# Altium project GL3520 4 Ports.PrjPcb
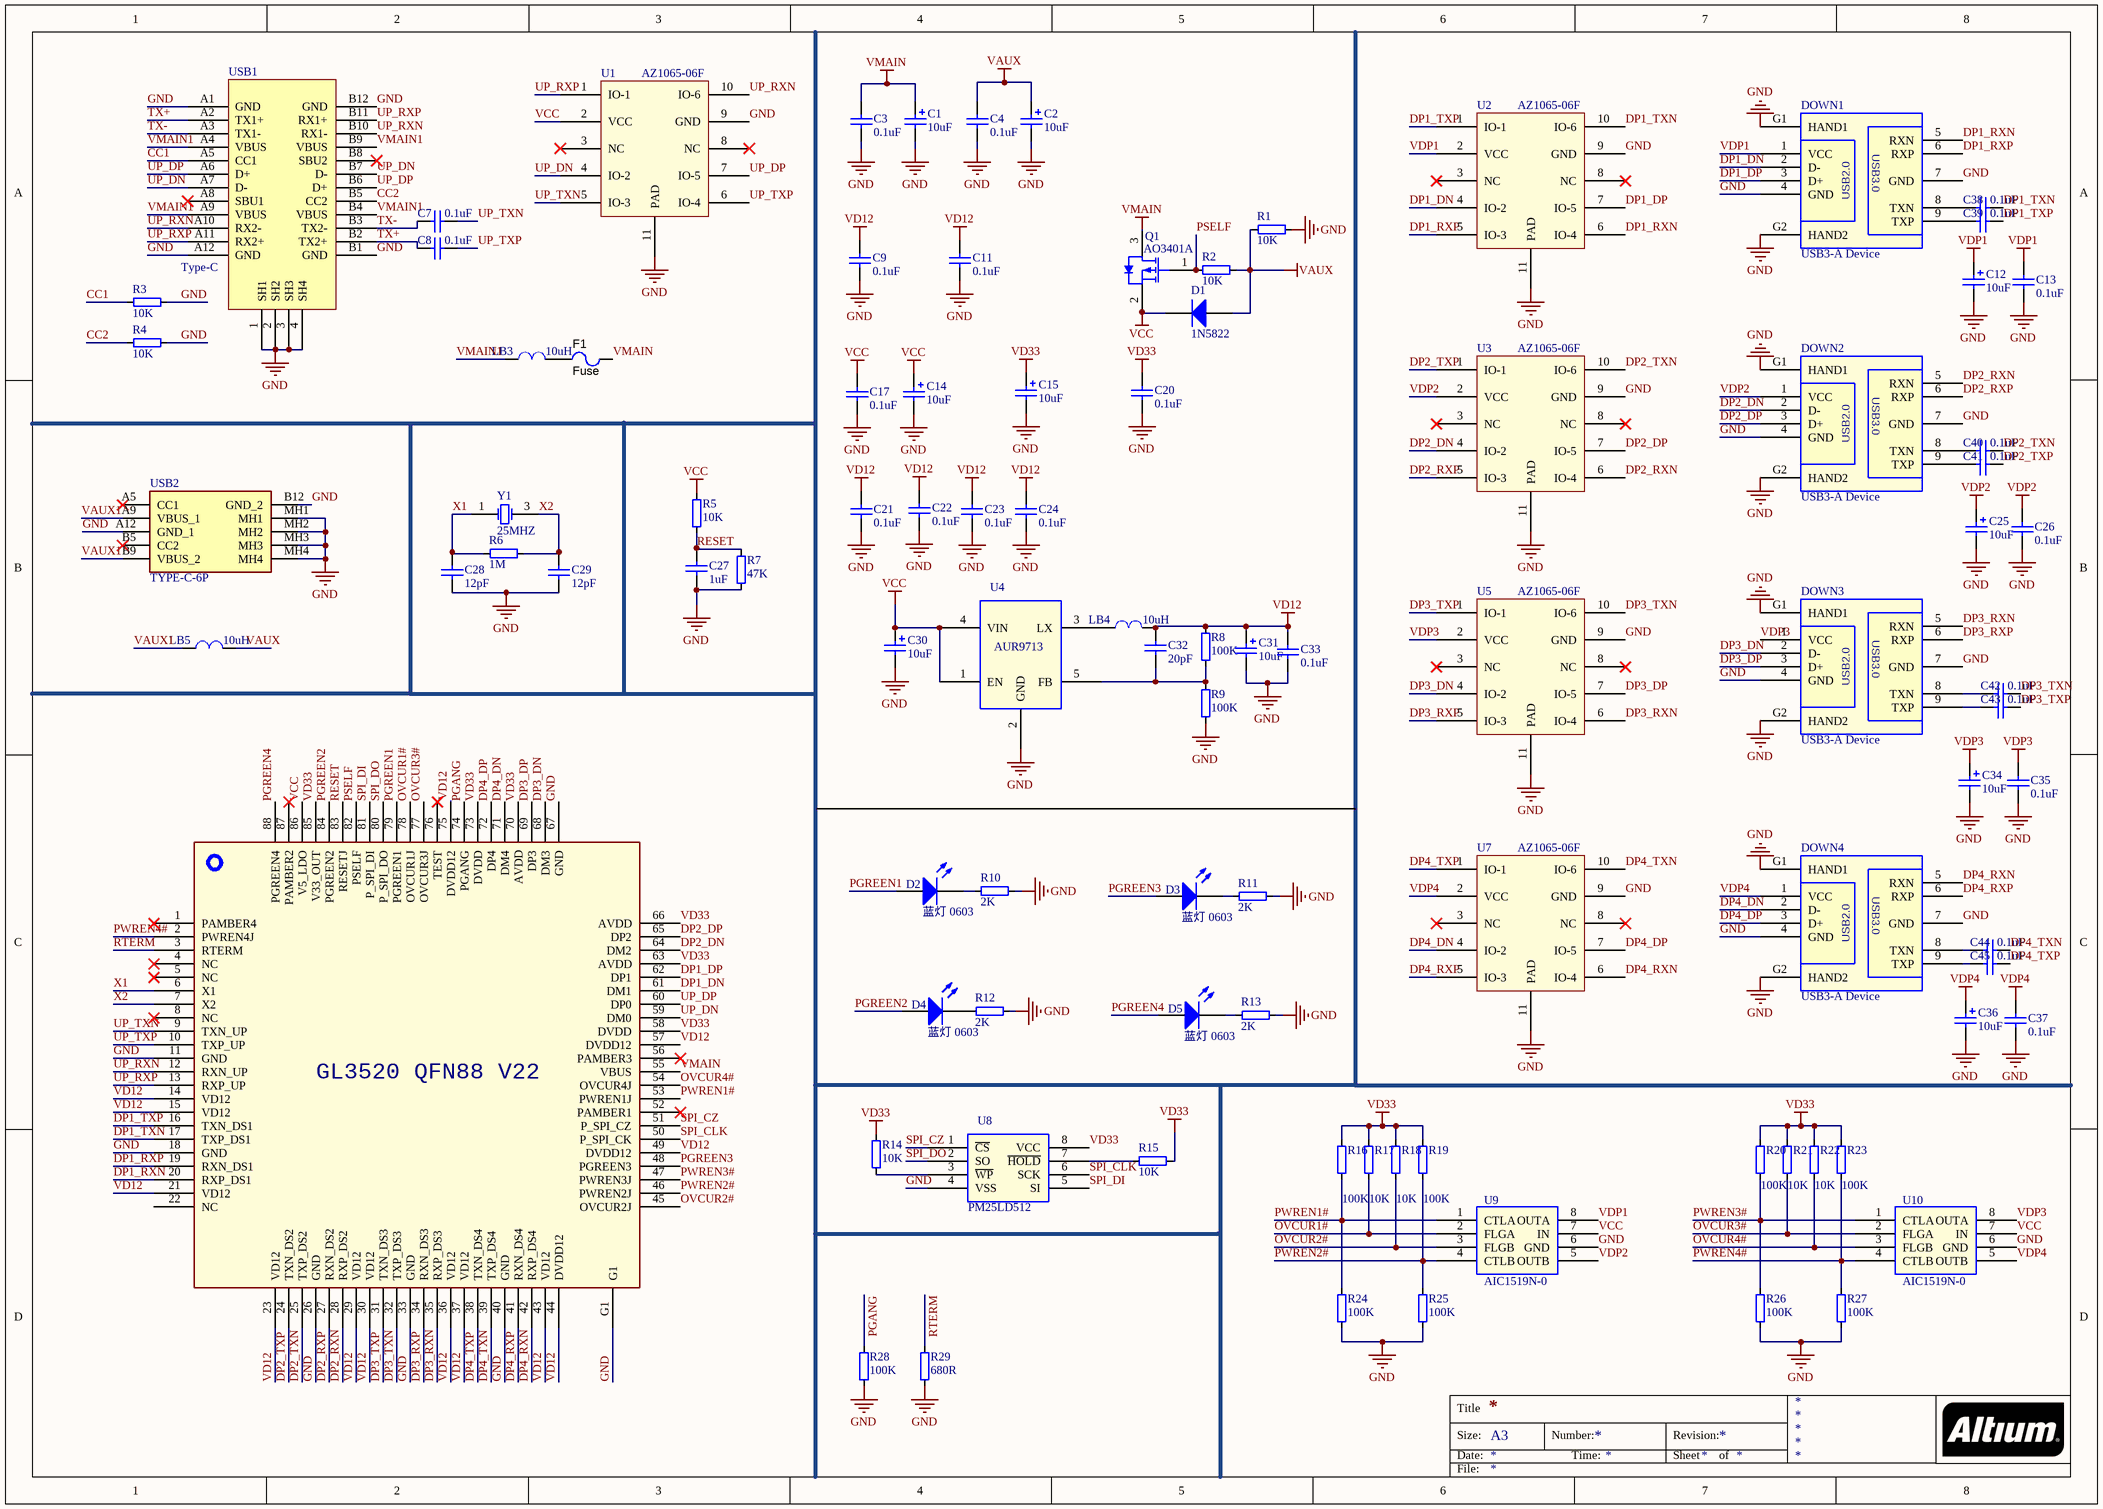
[diagram p0: GL3520 4 Ports.SchDoc]
1 sheet, 95 parts. Net scope: global (net labels, ports and power ports of the same name join across sheets).
Board files: GL3520 4 Ports.PcbDoc, GL3520 4 Ports (final).PcbDoc

## Sheet GL3520 4 Ports.SchDoc
size A3

### Parts
C1  10uF  [CASE-A_3216]
C2  10uF  [CASE-A_3216]
C3  0.1uF  [C 0603_L]
C4  0.1uF  [C 0603_L]
C7  0.1uF  [C 0603_L]
C8  0.1uF  [C 0603_L]
C9  0.1uF  [C 0603_L]
C11  0.1uF  [C 0603_L]
C12  10uF  [CASE-A_3216]
C13  0.1uF  [C 0603_L]
C14  10uF  [CASE-A_3216]
C15  10uF  [CASE-A_3216]
C17  0.1uF  [C 0603_L]
C20  0.1uF  [C 0603_L]
C21  0.1uF  [C 0603_L]
C22  0.1uF  [C 0603_L]
C23  0.1uF  [C 0603_L]
C24  0.1uF  [C 0603_L]
C25  10uF  [CASE-A_3216]
C26  0.1uF  [C 0603_L]
C27  1uF  [C 0603_L]
C28  12pF  [C 0603_L]
C29  12pF  [C 0603_L]
C30  10uF  [CASE-A_3216]
C31  10uF  [CASE-A_3216]
C32  20pF  [C 0603_L]
C33  0.1uF  [C 0603_L]
C34  10uF  [CASE-A_3216]
C35  0.1uF  [C 0603_L]
C36  10uF  [CASE-A_3216]
C37  0.1uF  [C 0603_L]
C38  0.1uF  [C 0603_L]
C39  0.1uF  [C 0603_L]
C40  0.1uF  [C 0603_L]
C41  0.1uF  [C 0603_L]
C42  0.1uF  [C 0603_L]
C43  0.1uF  [C 0603_L]
C44  0.1uF  [C 0603_L]
C45  0.1uF  [C 0603_L]
D1  1N5822  [SMA]
D2  蓝灯 0603  [0603_LED_S1]
D3  蓝灯 0603  [0603_LED_S1]
D4  蓝灯 0603  [0603_LED_S1]
D5  蓝灯 0603  [0603_LED_S1]
DOWN1  USB3-A Device  [USB3.0-1 - duplicate]
DOWN2  USB3-A Device  [USB3.0-1 - duplicate]
DOWN3  USB3-A Device  [USB3.0-1 - duplicate]
DOWN4  USB3-A Device  [USB3.0-1 - duplicate]
F1  Fuse  [FU 1206]
LB3  10uH  [CD43]
LB4  10uH  [CD43]
LB5  10uH  [CD43]
Q1  AO3401A  [SOT23-3L]
R1  10K  [R 0603_L]
R2  10K  [R 0603_L]
R3  10K  [R 0603_L]
R4  10K  [R 0603_L]
R5  10K  [R 0603_L]
R6  1M  [R 0603_L]
R7  47K  [R 0603_L]
R8  100K  [R 0603_L]
R9  100K  [R 0603_L]
R10  2K  [R 0603_L]
R11  2K  [R 0603_L]
R12  2K  [R 0603_L]
R13  2K  [R 0603_L]
R14  10K  [R 0603_L]
R15  10K  [R 0603_L]
R16  100K  [R 0603_L]
R17  10K  [R 0603_L]
R18  10K  [R 0603_L]
R19  100K  [R 0603_L]
R20  100K  [R 0603_L]
R21  10K  [R 0603_L]
R22  10K  [R 0603_L]
R23  100K  [R 0603_L]
R24  100K  [R 0603_L]
R25  100K  [R 0603_L]
R26  100K  [R 0603_L]
R27  100K  [R 0603_L]
R28  100K  [R 0603_L]
R29  680R  [R 0603_L]
U1  AZ1065-06F  [DFN4120P10E]
U2  AZ1065-06F  [DFN4120P10E]
U3  AZ1065-06F  [DFN4120P10E]
U4  AUR9713  [SOT23-5L]
U5  AZ1065-06F  [DFN4120P10E]
U6  GL3520_QFN88_V094-1_22  [QFN88]  (value not drawn)
U7  AZ1065-06F  [DFN4120P10E]
U8  PM25LD512  [SOP8W_M]
U9  AIC1519N-0  [SOP8_L]
U10  AIC1519N-0  [SOP8_L]
USB1  Type-C  [USB_TYPE_C_24P - duplicate - duplicate]
USB2  TYPE-C-6P  [USB_TYPE_C_6P]
Y1  25MHZ  [OSC 3225-4P]

### Nets
GND: C1.2 C2.2 C3.1 C4.1 C9.1 C11.1 C12.2 C13.1 C14.2 C15.2 C17.1 C20.1 C21.1 C22.1 C23.1 C24.1 C25.2 C26.1 C27.1 C28.1 C29.1 C30.2 C31.2 C33.1 C34.2 C35.1 C36.2 C37.1 DOWN1.4(GND) DOWN1.7(GND) DOWN1.G1(HAND1) DOWN1.G2(HAND2) DOWN2.4(GND) DOWN2.7(GND) DOWN2.G1(HAND1) DOWN2.G2(HAND2) DOWN3.4(GND) DOWN3.7(GND) DOWN3.G1(HAND1) DOWN3.G2(HAND2) DOWN4.4(GND) DOWN4.7(GND) DOWN4.G1(HAND1) DOWN4.G2(HAND2) R1.2 R3.2 R4.2 R7.1 R9.2 R10.1 R11.1 R12.1 R13.1 R24.2 R25.2 R26.2 R27.2 R28.2 R29.2 U1.9(GND) U1.11(PAD) U2.9(GND) U2.11(PAD) U3.9(GND) U3.11(PAD) U4.2(GND) U5.9(GND) U5.11(PAD) U6.11(GND) U6.18(GND) U6.26(GND) U6.33(GND) U6.40(GND) U6.67(GND) U6.G1 U7.9(GND) U7.11(PAD) U8.4(VSS) U9.6(GND) U10.6(GND) USB1.1(SH1) USB1.2(SH2) USB1.3(SH3) USB1.4(SH4) USB1.A1(GND) USB1.A12(GND) USB1.B1(GND) USB1.B12(GND) USB2.A12(GND_1) USB2.B12(GND_2) USB2.MH1 USB2.MH2 USB2.MH3 USB2.MH4
VAUX: C2.1 C4.2 D1.1(A) LB5.2 R1.1 R2.2
VCC: C14.1 C17.2 C30.1 D1.2(K) Q1.2(SOURCE) R5.2 U1.2(VCC) U4.1(EN) U4.4(VIN) U6.86(V5_LDO) U9.7(IN) U10.7(IN)
VD12: C9.2 C11.2 C21.2 C22.2 C23.2 C24.2 C31.1 C32.2 C33.2 LB4.2 R8.1 U6.14(VD12) U6.15(VD12) U6.21(VD12) U6.23(VD12) U6.29(VD12) U6.30(VD12) U6.36(VD12) U6.37(VD12) U6.43(VD12) U6.44(DVDD12) U6.49(DVDD12) U6.57(DVDD12) U6.75(DVDD12)
VD33: C15.1 C20.2 R14.1 R15.2 R16.1 R17.1 R18.1 R19.1 R20.1 R21.1 R22.1 R23.1 U6.58(DVDD) U6.63(AVDD) U6.66(AVDD) U6.70(AVDD) U6.73(DVDD) U6.85(V33_OUT) U8.8(VCC)
VDP1: C12.1 C13.2 DOWN1.1(VCC) U2.2(VCC) U9.8(OUTA)
VDP2: C25.1 C26.2 DOWN2.1(VCC) U3.2(VCC) U9.5(OUTB)
VDP3: C34.1 C35.2 DOWN3.1(VCC) U5.2(VCC) U10.8(OUTA)
VDP4: C36.1 C37.2 DOWN4.1(VCC) U7.2(VCC) U10.5(OUTB)
VMAIN: C1.1 C3.2 F1.1 Q1.3(DRAIN) U6.55(VBUS)
CC1: R3.1 USB1.A5(CC1)
CC2: R4.1 USB1.B5(CC2)
DP1_DN: DOWN1.2(D-) U2.4(IO-2) U6.61(DM1)
DP1_DP: DOWN1.3(D+) U2.7(IO-5) U6.62(DP1)
DP1_RXN: DOWN1.5(RXN) U2.6(IO-4) U6.20(RXP_DS1)
DP1_RXP: DOWN1.6(RXP) U2.5(IO-3) U6.19(RXN_DS1)
DP1_TXN: C38.1 U2.10(IO-6) U6.17(TXP_DS1)
DP1_TXP: C39.1 U2.1(IO-1) U6.16(TXN_DS1)
DP2_DN: DOWN2.2(D-) U3.4(IO-2) U6.64(DM2)
DP2_DP: DOWN2.3(D+) U3.7(IO-5) U6.65(DP2)
DP2_RXN: DOWN2.5(RXN) U3.6(IO-4) U6.28(RXP_DS2)
DP2_RXP: DOWN2.6(RXP) U3.5(IO-3) U6.27(RXN_DS2)
DP2_TXN: C40.1 U3.10(IO-6) U6.25(TXP_DS2)
DP2_TXP: C41.1 U3.1(IO-1) U6.24(TXN_DS2)
DP3_DN: DOWN3.2(D-) U5.4(IO-2) U6.68(DM3)
DP3_DP: DOWN3.3(D+) U5.7(IO-5) U6.69(DP3)
DP3_RXN: DOWN3.5(RXN) U5.6(IO-4) U6.35(RXP_DS3)
DP3_RXP: DOWN3.6(RXP) U5.5(IO-3) U6.34(RXN_DS3)
DP3_TXN: C42.1 U5.10(IO-6) U6.32(TXP_DS3)
DP3_TXP: C43.1 U5.1(IO-1) U6.31(TXN_DS3)
DP4_DN: DOWN4.2(D-) U6.71(DM4) U7.4(IO-2)
DP4_DP: DOWN4.3(D+) U6.72(DP4) U7.7(IO-5)
DP4_RXN: DOWN4.5(RXN) U6.42(RXP_DS4) U7.6(IO-4)
DP4_RXP: DOWN4.6(RXP) U6.41(RXN_DS4) U7.5(IO-3)
DP4_TXN: C44.1 U6.39(TXP_DS4) U7.10(IO-6)
DP4_TXP: C45.1 U6.38(TXN_DS4) U7.1(IO-1)
OVCUR1#: R17.2 U6.78(OVCUR1J) U9.2(FLGA)
OVCUR2#: R18.2 U6.45(OVCUR2J) U9.3(FLGB)
OVCUR3#: R21.2 U6.77(OVCUR3J) U10.2(FLGA)
OVCUR4#: R22.2 U6.54(OVCUR4J) U10.3(FLGB)
PGANG: R28.1 U6.74(PGANG)
PGREEN1: D2.A U6.79(PGREEN1)
PGREEN2: D4.A U6.84(PGREEN2)
PGREEN3: D3.A U6.48(PGREEN3)
PGREEN4: D5.A U6.88(PGREEN4)
PSELF: Q1.1(GATE) R2.1 U6.82(PSELF)
PWREN1#: R16.2 R24.1 U6.53(PWREN1J) U9.1(CTLA)
PWREN2#: R19.2 R25.1 U6.46(PWREN2J) U9.4(CTLB)
PWREN3#: R20.2 R26.1 U6.47(PWREN3J) U10.1(CTLA)
PWREN4#: R23.2 R27.1 U6.2(PWREN4J) U10.4(CTLB)
RESET: C27.2 R5.1 R7.2 U6.83(RESETJ)
RTERM: R29.1 U6.3(RTERM)
SPI_CLK: U6.50(P_SPI_CK) U8.6(SCK)
SPI_CZ: U6.51(P_SPI_CZ) U8.1(~{CS})
SPI_DI: U6.81(P_SPI_DI) U8.5(SI)
SPI_DO: U6.80(P_SPI_DO) U8.2(SO)
TX+: C8.2 USB1.A2(TX1+) USB1.B2(TX2+)
TX-: C7.2 USB1.A3(TX1-) USB1.B3(TX2-)
UP_DN: U1.4(IO-2) U6.59(DM0) USB1.A7(D-) USB1.B7(D-)
UP_DP: U1.7(IO-5) U6.60(DP0) USB1.A6(D+) USB1.B6(D+)
UP_RXN: U1.10(IO-6) U6.12(RXN_UP) USB1.A10(RX2-) USB1.B10(RX1-)
UP_RXP: U1.1(IO-1) U6.13(RXP_UP) USB1.A11(RX2+) USB1.B11(RX1+)
UP_TXN: C7.1 U1.5(IO-3) U6.9(TXN_UP)
UP_TXP: C8.1 U1.6(IO-4) U6.10(TXP_UP)
VAUX1: LB5.1 USB2.A9(VBUS_1) USB2.B9(VBUS_2)
VMAIN1: LB3.1 USB1.A4(VBUS) USB1.A9(VBUS) USB1.B4(VBUS) USB1.B9(VBUS)
X1: C28.2 R6.1 U6.6(X1) Y1.1(OSC1)
X2: C29.2 R6.2 U6.7(X2) Y1.3(OSC2)
NetC32_1: C32.1 R8.2 R9.1 U4.5(FB)
NetC38_2: C38.2 DOWN1.8(TXN)
NetC39_2: C39.2 DOWN1.9(TXP)
NetC40_2: C40.2 DOWN2.8(TXN)
NetC41_2: C41.2 DOWN2.9(TXP)
NetC42_2: C42.2 DOWN3.8(TXN)
NetC43_2: C43.2 DOWN3.9(TXP)
NetC44_2: C44.2 DOWN4.8(TXN)
NetC45_2: C45.2 DOWN4.9(TXP)
NetD2_K: D2.K R10.2
NetD3_K: D3.K R11.2
NetD4_K: D4.K R12.2
NetD5_K: D5.K R13.2
NetF1_2: F1.2 LB3.2
NetLB4_1: LB4.1 U4.3(LX)
NetR14_2: R14.2 U8.3(~{WP})
NetR15_1: R15.1 U8.7(~{HOLD})

Not connected (* = marked no-connect by the designer): U1 3(NC)* 8(NC)*; U2 3(NC)* 8(NC)*; U3 3(NC)* 8(NC)*; U5 3(NC)* 8(NC)*; U6 1(PAMBER4)* 4(NC)* 5(NC)* 8(NC)* 22(NC) 52(PAMBER1)* 56(PAMBER3)* 76(TEST)* 87(PAMBER2)*; U7 3(NC)* 8(NC)*; USB1 A8(SBU1)* B8(SBU2)*; USB2 A5(CC1)* B5(CC2)*

### Notes on the sheet
- Title
- Size:
- Date:
- A3
- Number:
- Time:
- Revision:
- Sheet
- of
- File:
- (in symbol GL3520_QFN88_V094-1_22) GL3520 QFN88 V22
- (in symbol USB3-A_5) USB3.0; USB2.0

### Library data of the parts
C1 C2 C14 C15 = 3216 10uF (106) 10% 16V: 钽电容1206; ComponentLink1Description: 供应商链接; ComponentLink1URL: http://www.szlcsc.com/product/details_7643.html; Package: 3216; Supplier: LC; SuppliersPartNumber: C7171
C3 C4 C7-C9 C11 C13 C17 C20-C24 C26-C29 C32 C33 C35 C37-C45 = 0603 2.2uF (225) 10% 16V: 贴片电容; ComponentLink1Description: 供应商链接; ComponentLink1URL: http://www.szlcsc.com/product/details_24366.html; Package: 0603; Supplier: LC; SuppliersPartNumber: C23630
C12 C25 C30 C31 C34 C36 = 3216 10uF (106) 10% 16V: 钽电容; ComponentLink1Description: 供应商链接; ComponentLink1URL: http://www.szlcsc.com/product/details_7643.html; Package: 3216; Supplier: LC; SuppliersPartNumber: C7171
D1 = Diode 1N5400: 3 Amp General Purpose Rectifier; Published: 8-Jun-2000; LatestRevisionDate: 17-Jul-2002; LatestRevisionNote: Re-released for DXP Platform.; DatasheetVersion: 1998; PackageVersion: Aug-1999; PackageReference: DO-201AD; Publisher: Altium Limited; PackageDescription: Diode, Axial; Body 9.5 x 5.6 mm (LxDia. max), Lead Dia. 1.32 mm (max); ComponentLink1Description: Manufacturer Link; ComponentLink1URL: http://www.fairchildsemi.com/; ComponentLink2Description: Datasheet; ComponentLink2URL: http://www.fairchildsemi.com/ds/1N%2F1N5400.pdf
D2-D5 = 0603 蓝灯: 发光二极管; ComponentLink1Description: 供应商链接; ComponentLink1URL: http://www.szlcsc.com/product/details_73150.html; Package: 0603; Supplier: LC; SuppliersPartNumber: C72041
DOWN1-DOWN4 = USB3-A_5: PCB Footprint: CND-USB3A-A
F1 = Fuse: PartNumber: NANOSMDC020F-2; Manufacturer: TE Connectivity; VDC_V: 24; Rtyp_Ohm: 1.875; SymbolCreator: a0412235; SymbolVersion: 2013-04-02; PackageReference: 1206; MountType: SMT; CompType: Fuse; RoHS: Y; Published: 2009-03-05; Publisher: Texas Instruments; LatestRevisionDate: 2015-11-23; ComponentLink1Description: Datasheet URL; ComponentLink1URL: http://www.te.com/commerce/DocumentDelivery/DDEController?Action=srchrtrv&DocNm=SCD25536&DocType=Customer+Drawing&DocLang=English; Supplier 1: Digi-Key; Supplier Part Number 1: NANOSMDC020F-2CT-ND; Supplier 2: Mouser; Supplier Part Number 2: 650-NANOSMDC020F-2; Supplier 3: Farnell; Supplier Part Number 3: 1345939
LB3-LB5 = L-0603: PCB Footprint: LBS-0603
Q1 = CMP-2000-05778-1: P-Channel MOSFET, 30 V, 4 A, -55 to 150 degC, 3-Pin SOT-23-3L, RoHS, Tape and Reel; Manufacturer: Alpha and Omega; Output Power (Max): NotRequiredW; Power Dissipation: 1.4W; Rad Hardened: No; Drain Efficiency: NotRequired%; Drain-Source On-Volt: 30V; Noise Figure: NotRequireddB; Frequency (Max): NotRequiredMHz; Number of  Elements: 1; Gate-Source Voltage (Max): ?12V; Drain Current (Max): 4A; Channel Mode: Enhancement; Drain-Source On-Res: 0.044ohm; Type: PowerMOSFET; Polarity: P; Package URL: http://www.aosmd.com/res/packaging_information/SOT-23-3L.pdf; Datasheet URL: http://www.aosmd.com/res/data_sheets/AO3401A.pdf; Package Type: SOT-23; Package Description: 3-Pin Small Outline Transistor, Body 2.95 x 1.6 mm, Pitch 0.95 mm; Mounting: SurfaceMount; Manufacturer URL: http://www.aosmd.com/; Continuous Drain Current: 4A; Package Reference: SOT-23-3L; Mounting Technology: SurfaceMount; Operating Temperature Classification: Military; Power Gain: NotRequireddB; Datasheet Version: Rev. 3, 03/2011; Operating Temp Range: -55Cto150C; Pin Count: 3
R1-R29 = RES
U1-U3 U5 U7 = AZ1065-06F: 晶炎AZ1065-06F.R7G DFN4120 丝印119 ESD/TVS静电保护二极管
U4 = AUR9705_3: PCB Footprint: I-TSOT23-5P-2_9x1_6x0_95A
U8 = CAT25C128/256: PCB Footprint: I-SOP8-1_27A
U9 U10 = AIC1526-SOP: PCB Footprint: I-SOP8-1_27A
USB2 = TYPE-C-31-M-17: Connector; Manufacturer_Name: Korean Hroparts Elec; Datasheet Link: https://datasheet.lcsc.com/szlcsc/1903211732_Korean-Hroparts-Elec-TYPE-C-31-M-17_C283540.pdf; Height: 3.26mm; Manufacturer_Part_Number: TYPE-C-31-M-17; Arrow Part Number: TYPE-C-31-M-17
Y1 = SMD-3225_4P  25MHZ 12PF 10PPM: 贴片晶振; ComponentLink1Description: 供应商链接; ComponentLink1URL: http://www.szlcsc.com/product/details_9526.html; Package: SMD-3225_4P; Supplier: LC; SuppliersPartNumber: C9006